# Altium schematic sheet STM32_BootSelector.SchDoc
size Letter
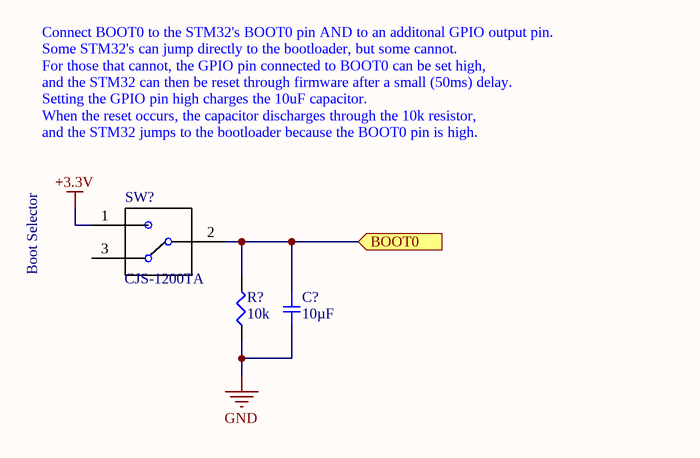
[diagram p0: STM32_BootSelector.SchDoc]

## Parts
C?  10µF  [SMD-0603C]
R?  10k  [SMD-0603-RES]
SW?  CJS-1200TA  [CJS-1200TA]

## Ports
BOOT0 (in)

## Nets
+3.3V: SW?.1
GND: C?.2 R?.1
BOOT0: C?.1 R?.2 SW?.2 ; port BOOT0

Not connected (* = marked no-connect by the designer): SW? 3

## Notes on the sheet
- Connect BOOT0 to the STM32's BOOT0 pin AND to an additonal GPIO output pin.
- Some STM32's can jump directly to the bootloader, but some cannot.
- For those that cannot, the GPIO pin connected to BOOT0 can be set high,
- and the STM32 can then be reset through firmware after a small (50ms) delay.
- Setting the GPIO pin high charges the 10uF capacitor.
- When the reset occurs, the capacitor discharges through the 10k resistor,
- and the STM32 jumps to the bootloader because the BOOT0 pin is high.
- Boot Selector

## Library data of the parts
C? = GRM185R60J106ME15D: CAP CER 10UF 6.3V X5R 0603; Manufacturer: Murata Electronics North America; Factory Stock: 0; Unit Price (USD): 0.36; Minimum Quantity: 1; Tolerance: ±20%; Datasheets: http://www.murata.com/~/media/webrenewal/support/library/catalog/products/capacitor/mlcc/c02e.pdf; Image: //media.digikey.com/Renders/Murata%20Renders/ZRB-SERIES-0402.jpg; Digi-Key Part Number: 490-10467-1-ND; Part Number: GRM185R60J106ME15D; Quantity Available: 25068; @ qty: 0; Packaging: Cut Tape (CT); Series: GRM; Part Status: Active; Value: 10µF; Voltage: 6.3V; Temperature Coefficient: X5R; Operating Temperature: -55°C ~ 85°C; Features: Derating Recommended; Ratings: -; Applications: General Purpose; Mounting Type: Surface Mount, MLCC; Package / Case: 0603 (1608 Metric); Size / Dimension: 0.063" L x 0.031" W (1.60mm x 0.80mm); Height - Seated (Max): -; Thickness (Max): 0.022" (0.55mm); Lead Spacing: -; Lead Style: -
R? = ERJ-3EKF1002V: RES SMD 10K OHM 1% 1/10W 0603; Manufacturer: Panasonic Electronic Components; Factory Stock: 0; Unit Price (USD): 0.00379; @ qty: 1500; Minimum Quantity: 1; Power (Watts): 0.1W, 1/10W; Temperature Coefficient: ±100ppm/°C; Part Number: ERJ-3EKF1002V; Datasheets: http://industrial.panasonic.com/www-cgi/jvcr13pz.cgi?E+PZ+3+AOA0002+ERJ3EKF1002V+7+WW; Image: //media.digikey.com/Photos/Panasonic%20Photos/MFG_ERJ-P6W%20Series.jpg; Digi-Key Part Number: P10.0KHCT-ND; Quantity Available: 6703141; Packaging: Cut Tape (CT); Series: ERJ; Part Status: Active; Value: 10k; Tolerance: ±1%; Composition: Thick Film; Features: Automotive AEC-Q200; Operating Temperature: -55°C ~ 155°C; Package / Case: 0603 (1608 Metric); Supplier Device Package: 0603; Size / Dimension: 0.063" L x 0.031" W (1.60mm x 0.80mm); Height - Seated (Max): 0.022" (0.55mm); Number of Terminations: 2; Failure Rate: -
SW? = CJS-1200TA: SWITCH SLIDE SPDT 100MA 6V / Manufacturer PN: CJS-1200TA; MF: Nidec Copal; Package: None; Digi-Key_Purchase_URL: https://www.digikey.com/product-detail/en/nidec-copal-electronics/CJS-1200TA/563-1021-1-ND/948401?utm_source=snapeda&utm_medium=aggregator&utm_campaign=symbol; Digi-Key_Part_Number: 563-1021-1-ND; SnapEDA_Link: https://www.snapeda.com/parts/CJS-1200TA/Nidec%20Copal%20Electronics/view-part/?ref=snap; MP: CJS-1200TA; Value: *